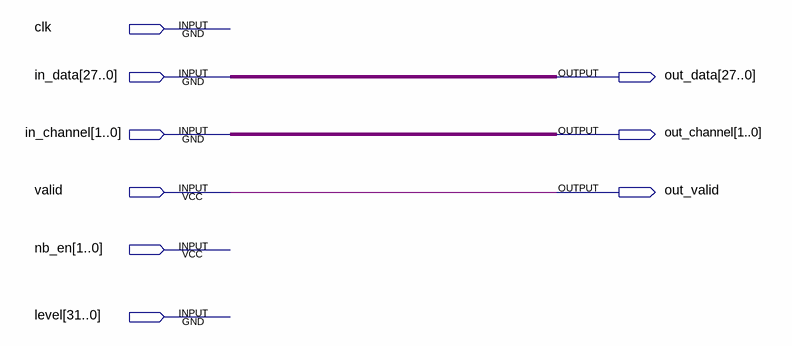
[diagram p0: schematic sheet]
// Quartus schematic noise_bl_4.bdf as structural Verilog: 0 symbols, 9 pins
module noise_bl_4 (
  input  clk,
  input  [27:0] in_data,
  input  [1:0] in_channel,
  input  valid,
  input  [1:0] nb_en,
  input  [31:0] level,
  output [27:0] out_data,
  output [1:0] out_channel,
  output out_valid
);


  assign out_channel = in_channel;
  assign out_data = in_data;
  assign out_valid = valid;
endmodule
